# EasyEDA Pro project ProProject_FPGA_oscilloscope Analog pre circuit PCB_2024-04-16.epro, schematic Schematic1
Create Date: 2024-04-14; Page Name: P1; Project Name: FPGA_oscilloscope Analog pre circuit PCB; Schematic Name: Schematic1; Update Date: 2024-04-14; Company: 嘉立创EDA; Page Size: A4; Version: V1.0
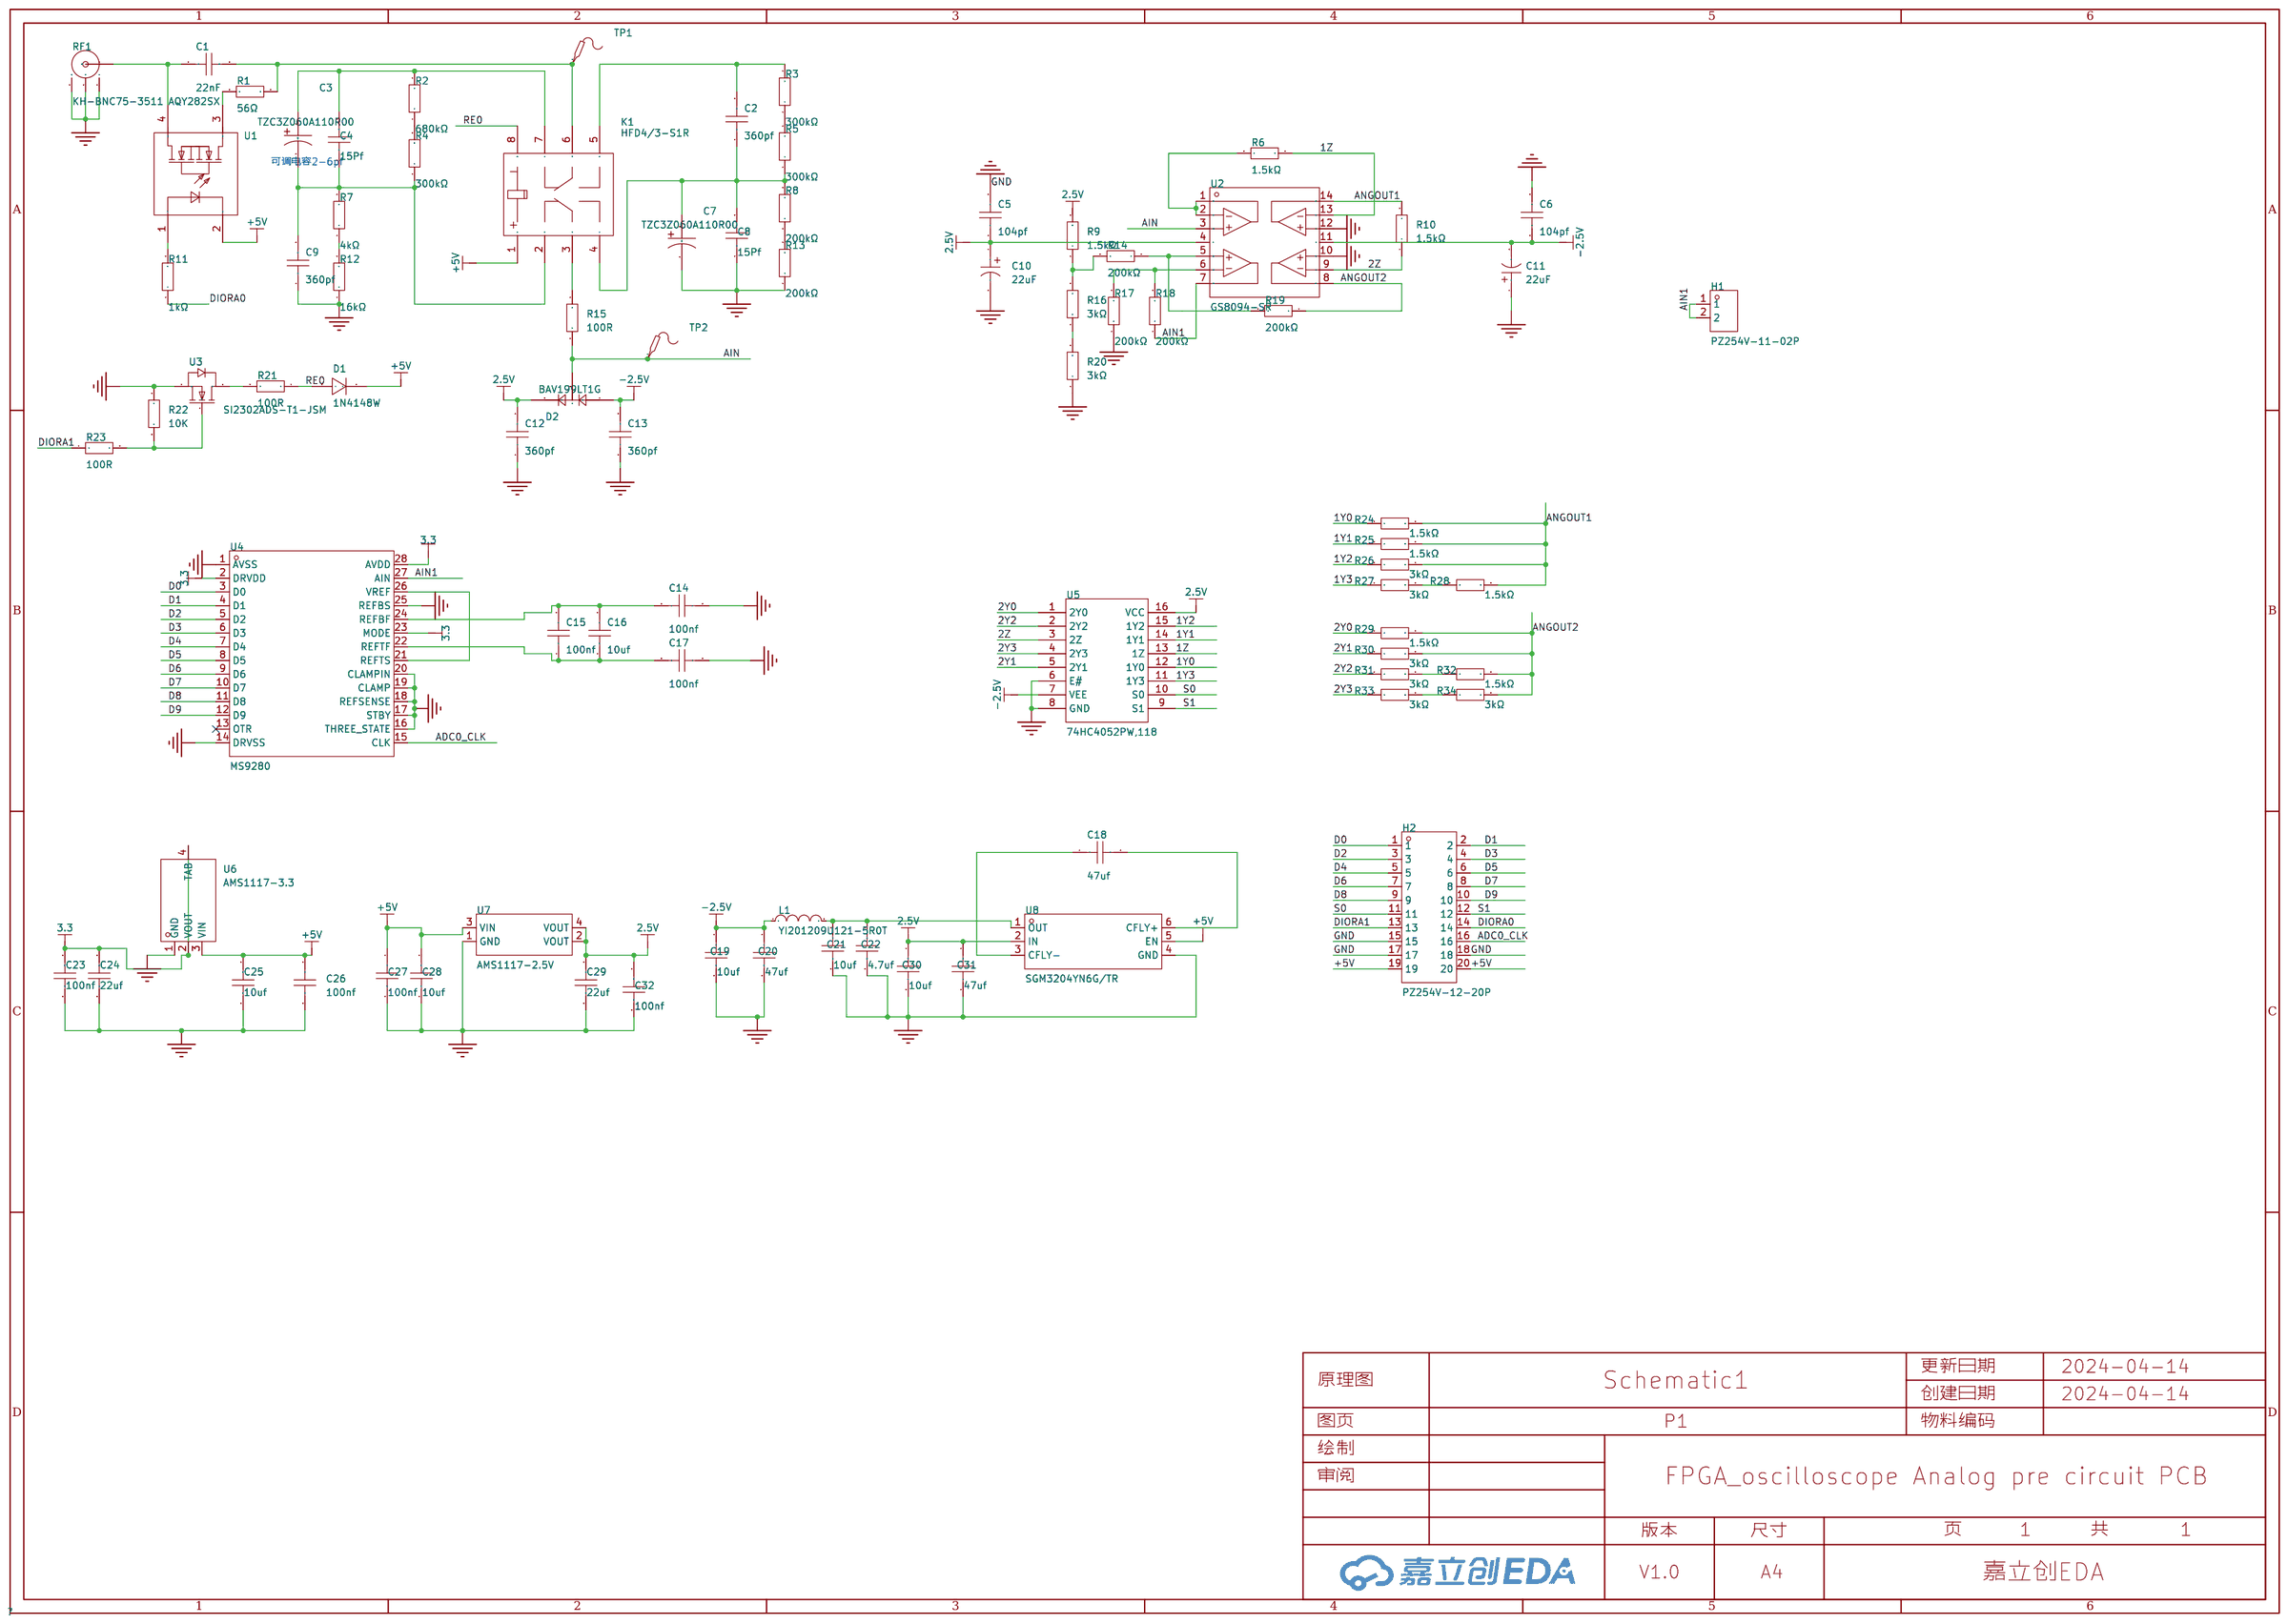
[diagram p1: schematic sheet]

## Parts
C1  22nF  [C0603]
C2  360pf  [C0603]
C3  TZC3Z060A110R00  [CAP-SMD_L4.50-W3.20]
C4  15Pf  [C0603]
C5  104pf  [C0603]
C6  104pf  [C0603]
C7  TZC3Z060A110R00  [CAP-SMD_L4.50-W3.20]
C8  15Pf  [C0603]
C9  360pf  [C0603]
C10  22uF  [CAP-SMD_BD4.0-L4.3-W4.3-FD-A]
C11  22uF  [CAP-SMD_BD4.0-L4.3-W4.3-FD-A]
C12  360pf  [C0603]
C13  360pf  [C0603]
C14  100nf  [C0603]
C15  100nf  [C0603]
C16  10uf  [C0603]
C17  100nf  [C0603]
C18  47uf  [C0603]
C19  10uf  [C0603]
C20  47uf  [C0603]
C21  10uf  [C0603]
C22  4.7uf  [C0603]
C23  100nf  [C0603]
C24  22uf  [C0603]
C25  10uf  [C0603]
C26  100nf  [C0603]
C27  100nf  [C0603]
C28  10uf  [C0603]
C29  22uf  [C0603]
C30  10uf  [C0603]
C31  47uf  [C0603]
C32  100nf  [C0603]
D1  1N4148W  [SOD-123_L2.8-W1.8-LS3.7-RD]
D2  BAV199LT1G  [SOT-23_L2.9-W1.3-P1.90-LS2.4-BR]
H1  PZ254V-11-02P  [HDR-TH_2P-P2.54-V-M]
H2  PZ254V-12-20P  [HDR-TH_20P-P2.54-V-M-R2-C10-S2.54]
K1  HFD4/3-S1R  [RELAY-SMD_HFD4-3-S1R]
L1  YI201209U121-5R0T  [L0805]
R1  56Ω  [R0603]
R2  680kΩ  [R0603]
R3  300kΩ  [R0603]
R4  300kΩ  [R0603]
R5  300kΩ  [R0603]
R6  1.5kΩ  [R0603]
R7  4kΩ  [R0603]
R8  200kΩ  [R0603]
R9  1.5kΩ  [R0603]
R10  1.5kΩ  [R0603]
R11  1kΩ  [R0603]
R12  16kΩ  [R0603]
R13  200kΩ  [R0603]
R14  200kΩ  [R0603]
R15  100R  [R0805]
R16  3kΩ  [R0603]
R17  200kΩ  [R0603]
R18  200kΩ  [R0603]
R19  200kΩ  [R0603]
R20  3kΩ  [R0603]
R21  100R  [R0603]
R22  10K  [R0603]
R23  100R  [R0603]
R24  1.5kΩ  [R0603]
R25  1.5kΩ  [R0603]
R26  3kΩ  [R0603]
R27  3kΩ  [R0603]
R28  1.5kΩ  [R0603]
R29  1.5kΩ  [R0603]
R30  3kΩ  [R0603]
R31  3kΩ  [R0603]
R32  1.5kΩ  [R0603]
R33  3kΩ  [R0603]
R34  3kΩ  [R0603]
RF1  KH-BNC75-3511  [ANT-TH_KH-BNC75-3511]
TP1  -  [Test-Point-0.5mm]
TP2  -  [Test-Point-0.5mm]
U1  AQY282SX  [SOP-4_L4.3-W4.4-P2.54-LS7.0-BL]
U2  GS8094-SR  [SOIC-14_L8.7-W3.9-P1.27-LS6.0-BL]
U3  SI2302ADS-T1-JSM  [SOT-23-3_L2.9-W1.3-P1.90-LS2.4-BR]
U4  MS9280  [SSOP-28_L10.2-W5.3-P0.65-LS7.8-BL]
U5  74HC4052PW,118  [TSSOP-16_L5.0-W4.4-P0.65-LS6.4-BL]
U6  AMS1117-3.3  [SOT-223-3_L6.5-W3.5-P3.05-LS7.0]
U7  AMS1117-2.5V  [SOT-223_L6.5-W3.5-P2.30-LS7.0-BR]
U8  SGM3204YN6G/TR  [SOT-23-6_L2.9-W1.6-P0.95-LS2.8-BR]

## Library data of the parts
C1 C2 C4-C6 C8 C9 C12-C32 = CC0603KRX7R9BB104: 容值:100nF;精度:±10%;额定电压:50V;材质(温度系数):X7R;; LCSC Part Name: 100nF ±10% 50V; Supplier Part: C14663; Manufacturer: YAGEO(国巨); Supplier Footprint: 0603; JLCPCB Part Class: 基础库; Datasheet: https://atta.szlcsc.com/upload/public/pdf/source/20180910/C282072_33301C7F631E79921B82A8DAC6BCC5B3.pdf; Supplier: LCSC; Tolerance: ±10%; Voltage Rated: 50V; Temperature Coefficient: X7R
C3 C7 = TZC3Z060A110R00: 静电容量:2pF~6pF;静电容量公差:0%~+50%;额定电压(Vdc):100V;Q值:500@1MHz;; LCSC Part Name: 2pF~6pF 100V; Supplier Part: C98107; Manufacturer: muRata(村田); Supplier Footprint: SMD,4.5x3.2mm; JLCPCB Part Class: 扩展库; Datasheet: https://atta.szlcsc.com/upload/public/pdf/source/20190613/C98107_4E252F435657FA4638F4846F0BD190EF.pdf; Supplier: LCSC; electrostatic capacity: 2pF~6pF; Tolerance: 0%~+50%; Rated Voltage: 100V; Q @ Freq: 500@1MHz; Operating Temperature: -25℃~+85℃
C10 C11 = RVT22UF16V67RV0017: 容值:22uF;精度:±20%;额定电压:16V;纹波电流:21mA@120Hz;等效串联电阻:-;; LCSC Part Name: 22uF ±20% 16V; Supplier Part: C2895280; Manufacturer: KNSCHA(科尼盛); Supplier Footprint: SMD,D4xL5.4mm; JLCPCB Part Class: 扩展库; Datasheet: https://atta.szlcsc.com/upload/public/pdf/source/20210913/F3045483CFF837C1D63EB135475AA9CE.pdf; Supplier: LCSC; Tolerance: ±20%; Rated Voltage: 16V; Ripple Current: 21mA@120Hz; φD: 4mm; L: 5.4mm; Lifetime @ Temp: 2000hrs@105℃; Operating Temperature: -55℃~+105℃
D1 = 1N4148W_C2099: 二极管配置:独立式;正向压降(Vf):1.25V@150mA;直流反向耐压(Vr):100V;平均整流电流(Io):150mA;功率:500mW;反向恢复时间(trr):4ns;; LCSC Part Name: 电压:100V 电流:150mA; Supplier Part: C2099; Manufacturer: CJ(江苏长电/长晶); Supplier Footprint: SOD-123; JLCPCB Part Class: 扩展库; Datasheet: https://atta.szlcsc.com/upload/public/pdf/source/20120428/1457706480199.pdf; Supplier: LCSC; Diode Configuration: 独立式; Forward Voltage (Vf@If): 1.25V@150mA; Reverse Voltage (Vr): 100V; Average Rectified Current (Io): 150mA; Power Dissipation: 500mW; Reverse Leakage Current: 1uA@75V; Reverse Recovery Time (trr): 4ns
D2 = BAV199LT1G: 二极管配置:1对串联式;正向压降(Vf):1.25V@150mA;直流反向耐压(Vr):70V;平均整流电流(Io):215mA;; LCSC Part Name: 电压:70V 电流:215mA; Supplier Part: C145516; Manufacturer: onsemi(安森美); Supplier Footprint: SOT-23; JLCPCB Part Class: 扩展库; Datasheet: https://atta.szlcsc.com/upload/public/pdf/source/20180112/C145516_15157255405661261285.PDF; Supplier: LCSC; Diode Configuration: 1对串联式; Forward Voltage (Vf@If): 1.25V@150mA; Reverse Voltage (Vr): 70V; Average Rectified Current (Io): 215mA; Reverse Leakage Current: 5uA@70V
H1 = PZ254V-11-02P: 插针结构:1x2P;间距:2.54mm;行距:-;圆针/方针:方针;安装类型:直插;排数:单排;总PIN位数:2P;额定电流:-;额定电压:-;配合针长度:6mm;塑高:2.5mm;端接针长度:3mm;触头材质:黄铜;触头镀层:-;工作温度范围:-40℃~+105℃;颜色:黑色;; LCSC Part Name: 间距:2.54mm 1x2P 直插 方针; Supplier Part: C492401; Manufacturer: XFCN(兴飞); Supplier Footprint: 插件,P=2.54mm; JLCPCB Part Class: 扩展库; Datasheet: https://atta.szlcsc.com/upload/public/pdf/source/20200309/C492401_A812433581A9B211A7FFA413ADDFF0E5.pdf; Supplier: LCSC; Pin Structure: 1x2P; Pitch: 2.54mm; Circluar Pins/Square Pins: 方针; Mounting Type: 直插; Number of Rows: 单排; Number of Pins: 2P; Length of Mating Pin: 6mm; Insulation Height: 2.5mm; Length of End Connection Pin: 3mm; Contact Material: 黄铜; Operating Temperature Range: -40℃~+105℃; Color: 黑色
H2 = PZ254V-12-20P: 插针结构:2x10P;间距:2.54mm;行距:2.54mm;圆针/方针:方针;安装类型:直插;排数:双排;总PIN位数:20P;额定电流:-;额定电压:-;配合针长度:6mm;塑高:2.5mm;端接针长度:3mm;触头材质:黄铜;触头镀层:-;工作温度范围:-40℃~+105℃;颜色:黑色;; LCSC Part Name: 间距:2.54mm 2x10P 直插 方针; Supplier Part: C492427; Manufacturer: XFCN(兴飞); Supplier Footprint: 插件,P=2.54mm; JLCPCB Part Class: 扩展库; Datasheet: https://atta.szlcsc.com/upload/public/pdf/source/20200309/C492427_9411E93D35F2EC20CED9A3ED9F4BBE60.pdf; Supplier: LCSC; Pin Structure: 2x10P; Pitch: 2.54mm; Row Spacing: 2.54mm; Circluar Pins/Square Pins: 方针; Mounting Type: 直插; Number of Rows: 双排; Number of Pins: 20P; Length of Mating Pin: 6mm; Insulation Height: 2.5mm; Length of End Connection Pin: 3mm; Contact Material: 黄铜; Operating Temperature Range: -40℃~+105℃; Color: 黑色
K1 = HFD4/3-S1R: 线圈电压:3V;触点形式:两组转换:2C(双刀双掷-转换);触点容量(电阻负载):1A@30VDC；300mA@125VAC;最大切换电压:250V@AC；220V@DC;最大切换电流:2A;; LCSC Part Name: 超小型3V继电器 双刀双掷; Supplier Part: C143232; Manufacturer: HF(宏发); Supplier Footprint: SMD,6.5x10mm; JLCPCB Part Class: 扩展库; Supplier: LCSC; Coil Voltage: 3V; Contact Form: 两组转换:2C(双刀双掷-转换); Pin Number: 8; Contact Rating: 1A@30VDC；300mA@125VAC; Maximum Switching Voltage: 250V@AC；220V@DC; Contact Material: AgNi+镀金; Coil Rated Power: 140mW; Coil Resistance: 64.3Ω; Maximum Switching Current: 2A; Operate Time: 3ms; Release Time: 3ms; Coil Type: 有极性-单线圈; Contact Resistance: 100mΩ; Operating Temperature: -40℃~+85℃
L1 = YI201209U121-5R0T: 标称阻抗@测试频率:120Ω@100MHz;误差:±25%;直流电阻(RDC):30mΩ;; LCSC Part Name: 0805磁珠 阻抗120Ω@100MHz; Supplier Part: C2971889; Manufacturer: YJYCOIN(益嘉源); Supplier Footprint: 0805; JLCPCB Part Class: 扩展库; Datasheet: https://atta.szlcsc.com/upload/public/pdf/source/20220124/0B82DFBCB0ECDB082B32D6E52BFF1CFB.pdf; Supplier: LCSC; Impedance @ Frequency: 120Ω@100MHz; Tolerance: ±25%; DC Resistance: 30mΩ; Current Rating: 5A
R1-R14 R16-R34 = 0603WAF1001T5E: 电阻类型:厚膜电阻;阻值:1kΩ;精度:±1%;功率:100mW;最大工作电压:75V;温度系数:±100ppm/℃;; LCSC Part Name: 1kΩ ±1% 100mW 厚膜电阻; Supplier Part: C21190; Manufacturer: UNI-ROYAL(厚声); Supplier Footprint: 0603; JLCPCB Part Class: 基础库; Datasheet: https://atta.szlcsc.com/upload/public/pdf/source/20200306/C422600_1E6D84923E4A46A82E41ADD87F860B5C.pdf; Supplier: LCSC; Type: 厚膜电阻; Tolerance: ±1%; Power(Watts): 100mW; Overload Voltage (Max): 75V; Temperature Coefficient: ±100ppm/℃; Operating Temperature Range: -55℃~+155℃
R15 = 0805W8F1001T5E: 电阻类型:厚膜电阻;阻值:1kΩ;精度:±1%;功率:125mW;最大工作电压:150V;温度系数:±100ppm/℃;; LCSC Part Name: 1kΩ ±1% 125mW 厚膜电阻; Supplier Part: C17513; Manufacturer: UNI-ROYAL(厚声); Supplier Footprint: 0805; JLCPCB Part Class: 基础库; Datasheet: https://atta.szlcsc.com/upload/public/pdf/source/20200306/C422600_1E6D84923E4A46A82E41ADD87F860B5C.pdf; Supplier: LCSC; Type: 厚膜电阻; Tolerance: ±1%; Power(Watts): 125mW; Overload Voltage (Max): 150V; Temperature Coefficient: ±100ppm/℃; Operating Temperature Range: -55℃~+155℃
RF1 = KH-BNC75-3511: 连接器类型:板端;接口类型:内孔;端口数量:1;接口直径:9.5mm;接口长度/高度:-;频率-最大值:3GHz;射频系列:BNC;阻抗:75Ω;样式:弯头;工作温度范围:-55℃~+155℃;; LCSC Part Name: BNC 内孔 弯头; Supplier Part: C2837588; Manufacturer: kinghelm(金航标); Supplier Footprint: 插件; JLCPCB Part Class: 扩展库; Datasheet: https://atta.szlcsc.com/upload/public/pdf/source/20221123/107886A8942993FCB0C00E519661A2AA.pdf; Supplier: LCSC; Connector Type: 板端; Interface Type: 内孔; Number of Ports: 1; Interface Diameter: 9.5mm; Frequency-Max: 3GHz; RF Series: BNC; Impedance: 75Ω; Style: 弯头; Operating Temperature Range: -55℃~+155℃
TP1 TP2 = Test-Point: Test Point 测试点
U1 = AQY282SX: 继电器触点形式:1 Form A(SPST-NO);适用负载类型:AC,DC;正向压降:1.14V;负载电压:60V;连续负载电流:500mA;导通电阻:850mΩ;; LCSC Part Name: 1 Form A(SPSTNO) 负载AC,DC 负载电压60V; Supplier Part: C250827; Manufacturer: PANASONIC(松下); Supplier Footprint: SOP-4-2.54mm; JLCPCB Part Class: 扩展库; Datasheet: https://atta.szlcsc.com/upload/public/pdf/source/20191104/C443818_6B9110F31C59FBA60B0CFD8E57AA94AC.pdf; Supplier: LCSC; Relay Contact Form: 1 Form A(SPST-NO); Load Type: AC,DC; Input Forward Voltage: 1.14V; Voltage - Load: 60V; Continuous Load Current: 500mA; On Resistance: 850mΩ; Isolation Voltage(rms): 1.5kV; Turn-on time: 900us; Turn-off time: 500us
U2 = GS8094-SR: 放大器数:四路;增益带宽积(GBP):180MHz;输入偏置电流(Ib):1pA;输入失调电压(Vos):2mV;带宽(-3db):180MHz;; Supplier Part: C157726; Manufacturer: Gainsil(聚洵); Supplier Footprint: SOIC-14; JLCPCB Part Class: 扩展库; Datasheet: https://atta.szlcsc.com/upload/public/pdf/source/20220610/E3748DDE2830B859623FB1BDA24ABCCF.pdf; Supplier: LCSC; Number of Circuits: 四路; Gain Bandwidth Product(GBP): 180MHz; Current - Input Bias(Ib): 1pA; Voltage - Input Offset(Vos): 2mV; -3db Bandwidth: 180MHz; Supply Current: 4.2mA
U3 = SI2302ADS-T1-JSM: Supplier Part: C6533558; Manufacturer: JSMSEMI(杰盛微); Supplier Footprint: SOT-23-3; JLCPCB Part Class: 扩展库; Datasheet: https://atta.szlcsc.com/upload/public/pdf/source/20230612/FFE5D426B922876E1ACE369FE8401F3F.pdf; Supplier: LCSC
U4 = MS9280: 接口:并行;电源电压:2.7V~5.5V;采样率:35MHz;分辨率:10位;; LCSC Part Name: 1通道 50MHz 10位ADC 并行接口; Supplier Part: C1509021; Manufacturer: 杭州瑞盟; Supplier Footprint: SSOP-28-208mil; JLCPCB Part Class: 扩展库; Datasheet: https://atta.szlcsc.com/upload/public/pdf/source/20231007/DECFDB597B151F846156A5BCFBCA36B2.pdf; Supplier: LCSC; Interface: 并行; number of channels: 1; Supply Voltage: 2.7V~5.5V; sampling frequency: 35MHz; resolution: 10位
U5 = 74HC4052PW,118: 开关电路:单刀四掷(SP4T);通道数:2;导通电阻(Ron@VCC):150Ω;; Supplier Part: C5646; Manufacturer: Nexperia(安世); Supplier Footprint: TSSOP-16; JLCPCB Part Class: 扩展库; Datasheet: https://atta.szlcsc.com/upload/public/pdf/source/20130225/1457706594415.pdf; Supplier: LCSC; Switch Circuit: 单刀四掷(SP4T); Number of Channels: 2; Supply Voltage: 2V~10V; Turn-on time: 58ns; On-State Resistance (Max): 150Ω; Turn-off time: 48ns
U6 = AMS1117-3.3_C5250992: 输出类型：固定 输出极性：正 最大输入电压：18V 输出电压：3.3V 输出电流：1A 电源纹波抑制比(PSRR)：60dB@(120Hz)。当前应用较多领域：三端稳压器，机顶盒; Supplier Part: C5250992; Manufacturer: TWGMC(台湾迪嘉); Supplier Footprint: SOT-223-3L; JLCPCB Part Class: 扩展库; Datasheet: https://atta.szlcsc.com/upload/public/pdf/source/20221109/A58A92B07670E85D28928AE371260E8D.pdf; Supplier: LCSC
U7 = AMS1117-2.5V_1: 输出类型:固定;最大输入电压:18V;输出电压:2.5V;最大输出电流:1A;电源纹波抑制比(PSRR):60dB@(120Hz);输出极性:正极;; LCSC Part Name: 正 Vin=18V Vout=2.5V 1A 60dB@(120Hz); Supplier Part: C5240656; Manufacturer: MSKSEMI(美森科); Supplier Footprint: SOT-223; JLCPCB Part Class: 扩展库; Datasheet: https://atta.szlcsc.com/upload/public/pdf/source/20230802/7000FCAFF33971783A269E7BD69EFE08.pdf; Supplier: LCSC; Output Type: 固定; Maximum Input Voltage: 18V; Output Voltage: 2.5V; MAX Output Current: 1A; Power Supply Rejection Ratio (PSRR): 60dB@(120Hz); Dropout Voltage: 1.3V@(1A); Output Polarity: 正极
U8 = SGM3204YN6G/TR: 功能类型:-;输入电压:1.4V~5.5V;输出电压:-5.5V~-1.4V;输出电流(最大值):200mA;; Supplier Part: C194031; Manufacturer: SGMICRO(圣邦微); Supplier Footprint: SOT-23-6; JLCPCB Part Class: 扩展库; Datasheet: https://atta.szlcsc.com/upload/public/pdf/source/20180627/C194031_755051E53122D645C36CF727711B963E.pdf; Supplier: LCSC; Input Voltage: 1.4V~5.5V; Output Voltage: -5.5V~-1.4V; Output Current (Max): 200mA; Switching Frequency: 950kHz; Number of Outputs: 1; Switch tube (built-in/external): 内置

## Nets
2.5V: C5.1 C10.1 C12.2 C29.1 C30.1 C31.1 C32.1 D2.2(C) R9.2 U2.4(V+) U5.16(VCC) U7.2(VOUT) U7.4(VOUT) U8.2(IN)
+5V: C25.1 C26.1 C27.1 C28.1 D1.1(K) H2.19 H2.20 K1.1 U1.2 U6.3(VIN) U7.3(VIN) U8.5(EN)
-2.5V: C6.1 C11.2 C13.2 C19.1 C20.1 D2.1(A) L1.1 U2.11(V-) U5.7(VEE)
GND: C5.2 C6.2 C7.2 C8.1 C9.1 C10.2 C11.1 C12.1 C13.1 C14.1 C17.1 C19.2 C20.2 C21.2 C22.2 C23.2 C24.2 C25.2 C26.2 C27.2 C28.2 C29.2 C30.2 C31.2 C32.2 H2.15 H2.17 H2.18 R12.1 R13.1 R17.1 R20.1 R22.1 RF1.2 RF1.3 RF1.4 U2.10(INC+) U2.12(IND+) U3.2(S) U4.1(AVSS) U4.14(DRVSS) U4.16(THREE_STATE) U4.17(STBY) U4.18(REFSENSE) U4.19(CLAMP) U4.20(CLAMPIN) U4.25(REFBS) U5.6(E#) U5.8(GND) U6.1(GND) U7.1(GND) U8.4(GND)
1Y0: R24.1 U5.12(1Y0)
1Y1: R25.1 U5.14(1Y1)
1Y2: R26.1 U5.15(1Y2)
1Y3: R27.1 U5.11(1Y3)
1Z: R6.1 U2.13(IND-) U5.13(1Z)
2Y0: R29.1 U5.1(2Y0)
2Y1: R30.1 U5.5(2Y1)
2Y2: R31.1 U5.2(2Y2)
2Y3: R33.1 U5.4(2Y3)
2Z: R10.1 U2.9(INC-) U5.3(2Z)
3.3: C23.1 C24.1 U4.2(DRVDD) U4.23(MODE) U4.28(AVDD) U6.2(VOUT) U6.4(TAB)
ADC0_CLK: H2.16 U4.15(CLK)
AIN: D2.3(C/A) R15.2 TP2.1 U2.3(INA+)
AIN1: H1.1 H1.2 R18.1 U2.7(OUTB) U4.27(AIN)
ANGOUT1: R10.2 R24.2 R25.2 R26.2 R28.2 U2.14(OUTD)
ANGOUT2: R19.1 R29.2 R30.2 R32.2 R34.2 U2.8(OUTC)
D0: H2.1 U4.3(D0)
D1: H2.2 U4.4(D1)
D2: H2.3 U4.5(D2)
D3: H2.4 U4.6(D3)
D4: H2.5 U4.7(D4)
D5: H2.6 U4.8(D5)
D6: H2.7 U4.9(D6)
D7: H2.8 U4.10(D7)
D8: H2.9 U4.11(D8)
D9: H2.10 U4.12(D9)
DIORA0: H2.14 R11.1
DIORA1: H2.13 R23.1
RE0: D1.2(A) K1.8 R21.1
S0: H2.11 U5.10(S0)
S1: H2.12 U5.9(S1)
$1N691: C1.1 RF1.1(OUT) U1.4
$1N857: R1.2 U1.3
$1N871: C1.2 K1.6 R1.1 TP1.1
Net-(C2-1): C2.1 C7.1 C8.2 K1.4 R5.1 R8.2
Net-(C2-2): C2.2 K1.5 R3.2
Net-(C3-1): C3.1 C4.2 K1.7 R2.2
Net-(C3-2): C3.2 C4.1 C9.2 K1.2 R4.1 R7.2
Net-(C14-2): C14.2 C15.2 C16.2 U4.24(REFBF)
Net-(C15-1): C15.1 C16.1 C17.2 U4.22(REFTF)
Net-(C18-1): C18.1 U8.3(CFLY-)
Net-(C18-2): C18.2 U8.6(CFLY+)
Net-(C21-1): C21.1 C22.1 L1.2 U8.1(OUT)
Net-(K1-3): K1.3 R15.1
Net-(R2-1): R2.1 R4.2
Net-(R3-1): R3.1 R5.2
Net-(R6-2): R6.2 U2.1(OUTA) U2.2(INA-)
Net-(R7-1): R7.1 R12.2
Net-(R8-1): R8.1 R13.2
Net-(R9-1): R9.1 R14.2 R16.2
Net-(R11-2): R11.2 U1.1
Net-(R14-1): R14.1 R19.2 U2.5(INB+)
Net-(R16-1): R16.1 R20.2
Net-(R17-2): R17.2 R18.2 U2.6(INB-)
Net-(R21-2): R21.2 U3.3(D)
Net-(R22-2): R22.2 R23.2 U3.1(G)
Net-(R27-2): R27.2 R28.1
Net-(R31-2): R31.2 R32.1
Net-(R33-2): R33.2 R34.1
Net-(U4-21): U4.21(REFTS) U4.26(VREF)

Not connected (* = marked no-connect by the designer): U4 13(OTR)*

## Notes on the sheet
- 可调电容2-6pf
